# EAGLE design Shield (EAGLE 6.2)
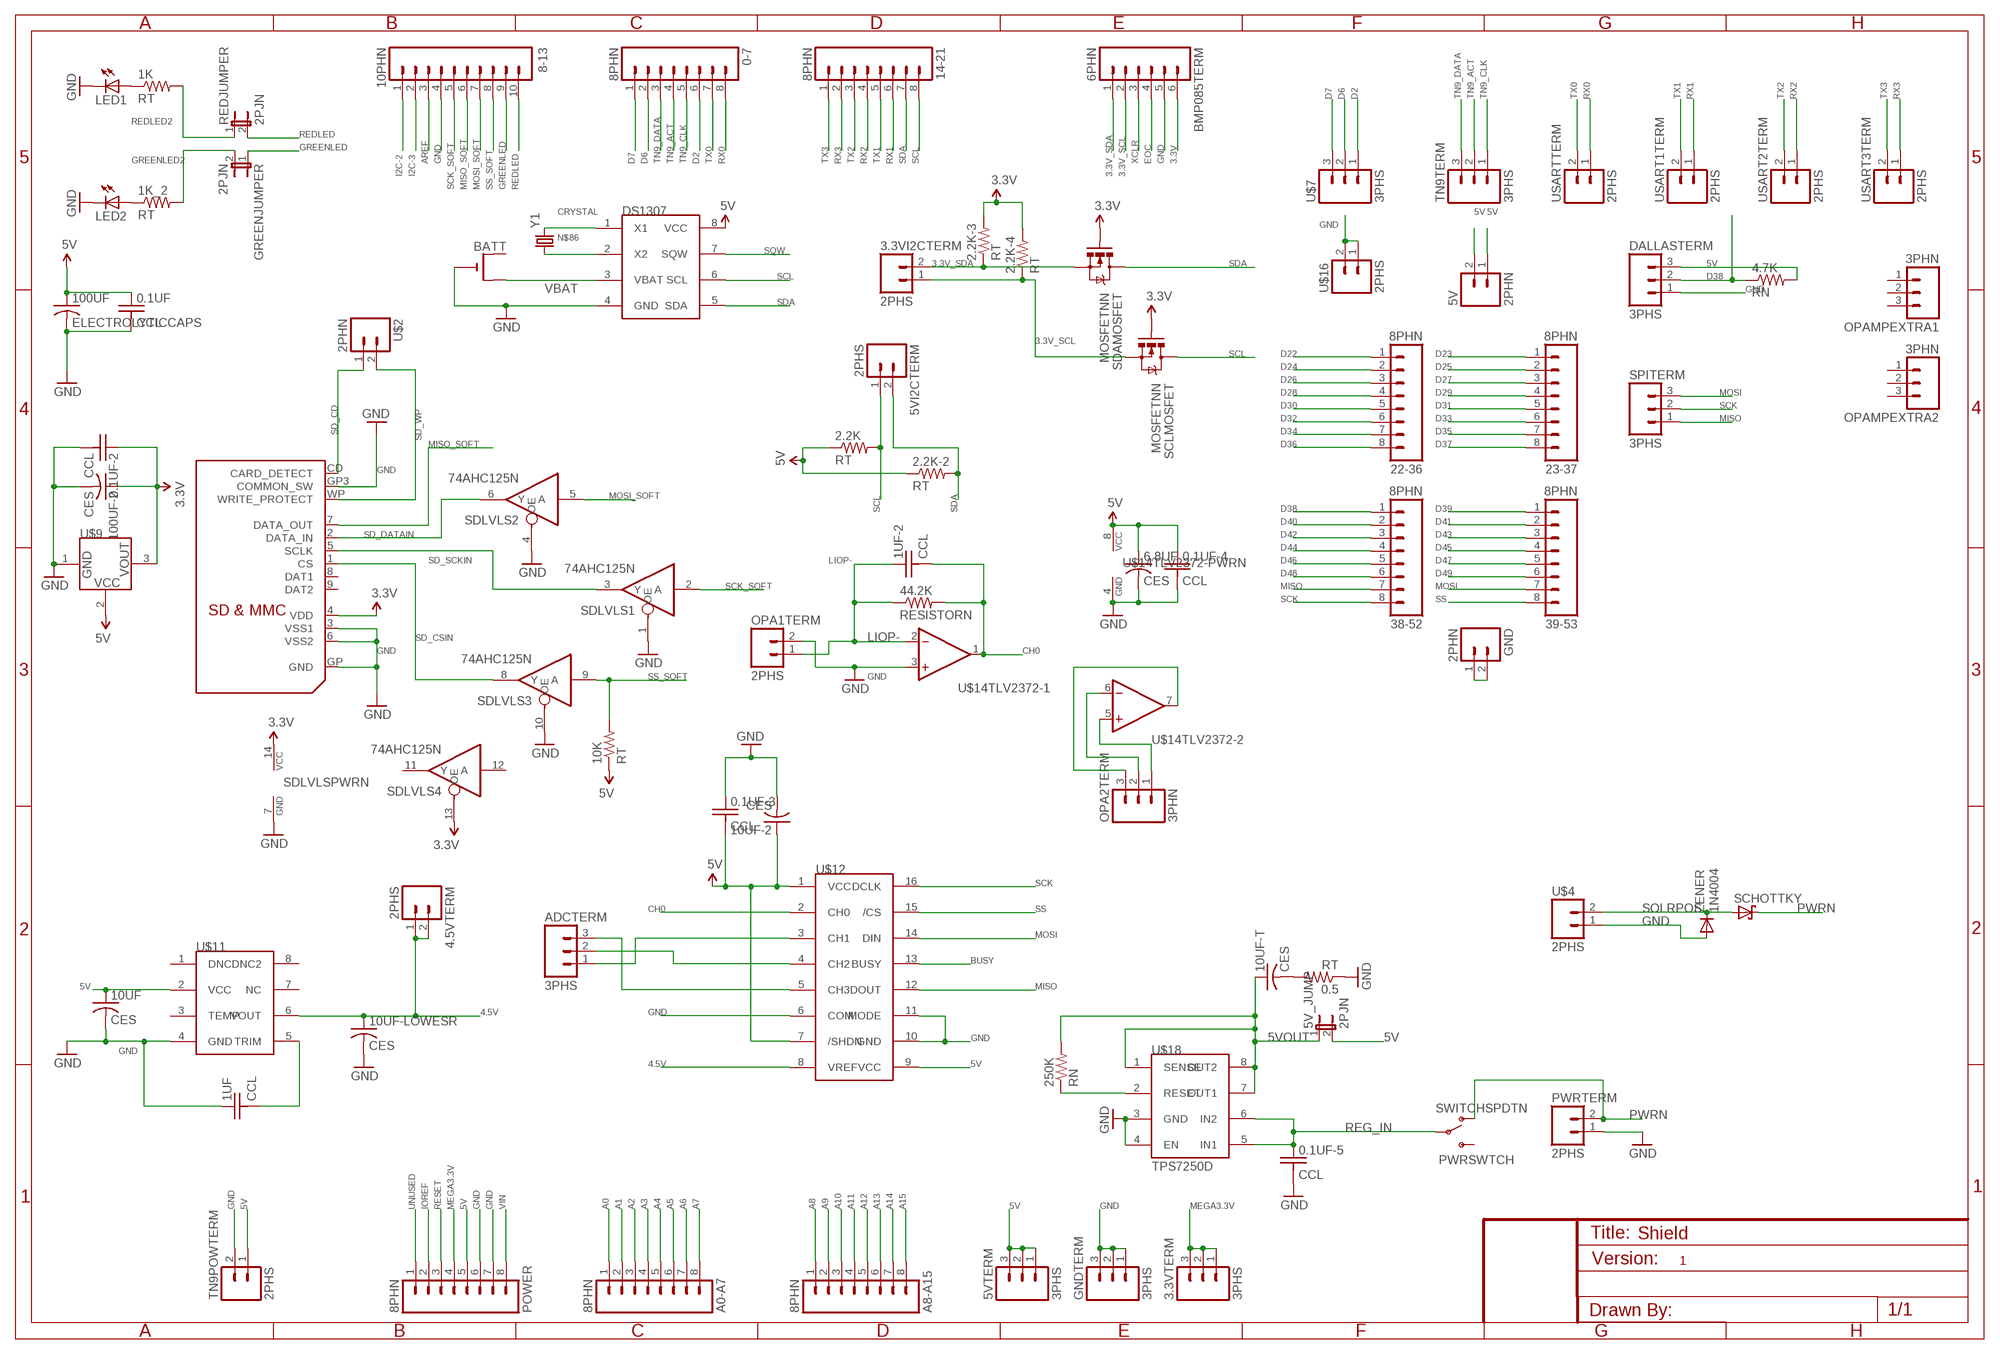
[diagram p0: schematic, sheet 1]

## Parts
0-7  8PHN  [8PH]
0.1UF  CCL  [C025-025X050]
0.1UF-2  CCL  [C025-025X050]
0.1UF-3  CCL  [C025-025X050]
0.1UF-4  CCL  [C025-025X050]
0.1UF-5  CCL  [C025-025X050]
0.5  RT  [0207/7]
1K  RT  [0207/7]
1K_2  RT  [0207/7]
1UF  CCL  [C025-025X050]
1UF-2  CCL  [C025-025X050]
2.2K  RT  [0207/7]
2.2K-2  RT  [0207/7]
2.2K-3  RT  [0207/7]
2.2K-4  RT  [0207/7]
3.3VI2CTERM  2PHS  [SCREWTERMINAL-3.5MM-2_LOCK]
3.3VTERM  3PHS  [SCREWTERMINAL-3.5MM-3_LOCK.007S]
4.5VTERM  2PHS  [SCREWTERMINAL-3.5MM-2_LOCK]
4.7K  RN  [0207/10]
5V  2PHN  [2PH]
5V_JUMP  2PJN  [2PH]
5VI2CTERM  2PHS  [SCREWTERMINAL-3.5MM-2_LOCK]
5VTERM  3PHS  [SCREWTERMINAL-3.5MM-3_LOCK.007S]
6.8UF  CES  [E2,5-5]
8-13  10PHN  [10PH]
10K  RT  [0207/7]
10UF  CES  [E2,5-5]
10UF-2  CES  [E2,5-5]
10UF-LOWESR  CES  [E2,5-5]
10UF-T  CES  [E2,5-5]
14-21  8PHN  [8PH]
22-36  8PHN  [8PH]
23-37  8PHN  [8PH]
38-52  8PHN  [8PH]
39-53  8PHN  [8PH]
44.2K  RESISTORN  [0207/10]
100UF  ELECTROLYTICCAPS  [E2,5-5]
100UF-2  CES  [E2,5-5]
250K  RN  [0207/10]
A0-A7  8PHN  [8PH]
A8-A15  8PHN  [8PH]
ADCTERM  3PHS  [SCREWTERMINAL-3.5MM-3_LOCK.007S]
BATT  CR1220THM  [CR1220-THM]
BMP085TERM  6PHN  [6PH]
DALLASTERM  3PHS  [SCREWTERMINAL-3.5MM-3_LOCK.007S]
DS1307  DS1307P  [DIL8]
GND  2PHN  [2PH]
GNDTERM  3PHS  [SCREWTERMINAL-3.5MM-3_LOCK.007S]
GREENJUMPER  2PJN  [2PH]
LED1  LED3MM  [LED3MM]
LED2  LED3MM  [LED3MM]
OPA1TERM  2PHS  [SCREWTERMINAL-3.5MM-2_LOCK]
OPA2TERM  3PHN  [3PH]
OPAMPEXTRA1  3PHN  [3PH]
OPAMPEXTRA2  3PHN  [3PH]
POWER  8PHN  [8PH]
PWRSWTCH  SWITCHSPDTN  [SWITCH-SPDT]
PWRTERM  2PHS  [SCREWTERMINAL-3.5MM-2_LOCK]
REDJUMPER  2PJN  [2PH]
SCHOTTKY  SCHOTTKY-DIODEDO41  [DO41-10]
SCLMOSFET  MOSFETNN  [TO-92INLINE]
SDAMOSFET  MOSFETNN  [TO-92INLINE]
SDLVLS  74AHC125N  [DIL14]
SPITERM  3PHS  [SCREWTERMINAL-3.5MM-3_LOCK.007S]
TN9POWTERM  2PHS  [SCREWTERMINAL-3.5MM-2_LOCK]
TN9TERM  3PHS  [SCREWTERMINAL-3.5MM-3_LOCK.007S]
U$1  SDMMC06132  [06132]
U$2  2PHN  [2PH]
U$4  2PHS  [SCREWTERMINAL-3.5MM-2_LOCK]
U$7  3PHS  [SCREWTERMINAL-3.5MM-3_LOCK.007S]
U$9  MCP1700-330T  [TO-92INLINE]
U$11  REF5045S  [SOIC8]
U$12  ADS7841P  [DIL16]
U$14  TLV2372P  [DIL8]
U$16  2PHS  [SCREWTERMINAL-3.5MM-2_LOCK]
U$18  TPS7250D  [DIL8]
USART1TERM  2PHS  [SCREWTERMINAL-3.5MM-2_LOCK]
USART2TERM  2PHS  [SCREWTERMINAL-3.5MM-2_LOCK]
USART3TERM  2PHS  [SCREWTERMINAL-3.5MM-2_LOCK]
USARTTERM  2PHS  [SCREWTERMINAL-3.5MM-2_LOCK]
Y1  CRYSTALTC38H  [TC38H]
ZENER  1N4004  [DO41-10]

## Nets
3.3V: 0.1UF-2.1 2.2K-3.2 2.2K-4.2 100UF-2.+ BMP085TERM.6 SCLMOSFET.2(G) SDAMOSFET.2(G) SDLVLS.13(4:OE) SDLVLS.14(PWRN:VCC) U$1.4(VDD) U$9.3(VOUT)
3.3V_SCL: 2.2K-4.1 3.3VI2CTERM.1 BMP085TERM.2 SCLMOSFET.1(S)
3.3V_SDA: 2.2K-3.1 3.3VI2CTERM.2 BMP085TERM.1 SDAMOSFET.1(S)
4.5V: 4.5VTERM.1 4.5VTERM.2 10UF-LOWESR.+ U$11.6(VOUT) U$12.8(VREF)
5V: 0.1UF-3.2 0.1UF-4.1 0.1UF.1 2.2K-2.1 2.2K.1 4.7K.2 5V.1 5V.2 5V_JUMP.2 5VTERM.1 5VTERM.2 5VTERM.3 6.8UF.+ 10K.1 10UF-2.+ 10UF.+ 100UF.+ DALLASTERM.3 DS1307.8(VCC) POWER.5 TN9POWTERM.1 U$9.2(VCC) U$11.2(VCC) U$12.1(VCC) U$12.7(/SHDN) U$12.9(VCC) U$14.8(TLV2372-PWRN:VCC)
5VOUT: 5V_JUMP.1 10UF-T.+ 250K.2 U$18.1(SENSE) U$18.7(OUT1) U$18.8(OUT2)
A0: A0-A7.1
A1: A0-A7.2
A2: A0-A7.3
A3: A0-A7.4
A4: A0-A7.5
A5: A0-A7.6
A6: A0-A7.7
A7: A0-A7.8
A8: A8-A15.1
A9: A8-A15.2
A10: A8-A15.3
A11: A8-A15.4
A12: A8-A15.5
A13: A8-A15.6
A14: A8-A15.7
A15: A8-A15.8
AREF: 8-13.3
BUSY: U$12.13(BUSY)
CH0: 1UF-2.2 44.2K.2 U$12.2(CH0) U$14.1(TLV2372-1:OUT)
CH1: ADCTERM.1 U$12.3(CH1)
CH2: ADCTERM.2 U$12.4(CH2)
CH3: ADCTERM.3 U$12.5(CH3)
CRYSTAL: DS1307.1(X1) Y1.2
D2: 0-7.6 U$7.1
D6: 0-7.2 U$7.2
D7: 0-7.1 U$7.3
D22: 22-36.1
D23: 23-37.1
D24: 22-36.2
D25: 23-37.2
D26: 22-36.3
D27: 23-37.3
D28: 22-36.4
D29: 23-37.4
D30: 22-36.5
D31: 23-37.5
D32: 22-36.6
D33: 23-37.6
D34: 22-36.7
D35: 23-37.7
D36: 22-36.8
D37: 23-37.8
D38: 4.7K.1 38-52.1 DALLASTERM.2
D39: 39-53.1
D40: 38-52.2
D41: 39-53.2
D42: 38-52.3
D43: 39-53.3
D44: 38-52.4
D45: 39-53.4
D46: 38-52.5
D47: 39-53.5
D48: 38-52.6
D49: 39-53.6
EOC: BMP085TERM.4
GND: 0.1UF-2.2 0.1UF-3.1 0.1UF-4.2 0.1UF-5.2 0.1UF.2 0.5.1 1UF.1 6.8UF.- 8-13.4 10UF-2.- 10UF-LOWESR.- 10UF.- 100UF-2.- 100UF.- BATT.- BMP085TERM.5 DALLASTERM.1 DS1307.4(GND) GNDTERM.1 GNDTERM.2 GNDTERM.3 LED1.K(C) LED2.K(C) OPA1TERM.2 POWER.6 POWER.7 PWRTERM.1 SDLVLS.1(1:OE) SDLVLS.4(2:OE) SDLVLS.7(PWRN:GND) SDLVLS.10(3:OE) TN9POWTERM.2 U$1.3(VSS1) U$1.6(VSS2) U$1.GP3(COMMON_SW) U$1.GP(GND) U$4.1 U$9.1(GND) U$11.4(GND) U$12.6(COM) U$12.10(GND) U$12.11(MODE) U$14.3(TLV2372-1:+IN) U$14.4(TLV2372-PWRN:GND) U$16.1 U$16.2 U$18.3(GND) U$18.4(EN) ZENER.A
GREENLED: 8-13.9 GREENJUMPER.1
GREENLED2: 1K_2.2 GREENJUMPER.2
I2C-2: 8-13.1
I2C-3: 8-13.2
IOREF: POWER.2
LIOP-: 1UF-2.1 44.2K.1 OPA1TERM.1 U$14.2(TLV2372-1:-IN)
MEGA3.3V: 3.3VTERM.1 3.3VTERM.2 3.3VTERM.3 POWER.4
MISO: 38-52.7 SPITERM.1 U$12.12(DOUT)
MISO_SOFT: 8-13.6 U$1.7(DATA_OUT)
MOSI: 39-53.7 SPITERM.3 U$12.14(DIN)
MOSI_SOFT: 8-13.7 SDLVLS.5(2:A)
N$1: 1UF.2 U$11.5(TRIM)
N$2: OPA2TERM.1 U$14.5(TLV2372-2:+IN)
N$3: OPA2TERM.2 U$14.6(TLV2372-2:-IN)
N$4: OPA2TERM.3 U$14.7(TLV2372-2:OUT)
N$5: GND.1 GND.2
N$6: 250K.1 U$18.2(RESET)
N$7: 0.5.2 10UF-T.-
N$83: 1K.1 LED1.A
N$84: 1K_2.1 LED2.A
N$86: DS1307.2(X2) Y1.1
PWRN: PWRSWTCH.1(O) PWRTERM.2 SCHOTTKY.C
REDLED: 8-13.10 REDJUMPER.2
REDLED2: 1K.2 REDJUMPER.1
REG_IN: 0.1UF-5.1 PWRSWTCH.2(P) U$18.5(IN1) U$18.6(IN2)
RESET: POWER.3
RX0: 0-7.8 USARTTERM.1
RX1: 14-21.6 USART1TERM.1
RX2: 14-21.4 USART2TERM.1
RX3: 14-21.2 USART3TERM.1
SCK: 38-52.8 SPITERM.2 U$12.16(DCLK)
SCK_SOFT: 8-13.5 SDLVLS.2(1:A)
SCL: 2.2K.2 5VI2CTERM.1 14-21.8 DS1307.6(SCL) SCLMOSFET.3(D)
SD_CD: U$1.CD(CARD_DETECT) U$2.1
SD_CSIN: SDLVLS.8(3:Y) U$1.1(CS)
SD_DATAIN: SDLVLS.6(2:Y) U$1.2(DATA_IN)
SD_SCKIN: SDLVLS.3(1:Y) U$1.5(SCLK)
SD_WP: U$1.WP(WRITE_PROTECT) U$2.2
SDA: 2.2K-2.2 5VI2CTERM.2 14-21.7 DS1307.5(SDA) SDAMOSFET.3(D)
SOLRPOS: SCHOTTKY.A U$4.2 ZENER.C
SQW: DS1307.7(SQW)
SS: 39-53.8 U$12.15(/CS)
SS_SOFT: 8-13.8 10K.2 SDLVLS.9(3:A)
TN9_ACT: 0-7.4 TN9TERM.2
TN9_CLK: 0-7.5 TN9TERM.1
TN9_DATA: 0-7.3 TN9TERM.3
TX0: 0-7.7 USARTTERM.2
TX1: 14-21.5 USART1TERM.2
TX2: 14-21.3 USART2TERM.2
TX3: 14-21.1 USART3TERM.2
UNUSED: POWER.1
VBAT: BATT.+2(+1) DS1307.3(VBAT)
VIN: POWER.8
XCLR: BMP085TERM.3
Unconnected: BATT.+1(+) OPAMPEXTRA1.1 OPAMPEXTRA1.2 OPAMPEXTRA1.3 OPAMPEXTRA2.1 OPAMPEXTRA2.2 OPAMPEXTRA2.3 PWRSWTCH.3(S) SDLVLS.11(4:Y) SDLVLS.12(4:A) U$1.8(DAT1) U$1.9(DAT2) U$11.1(DNC) U$11.3(TEMP) U$11.7(NC) U$11.8(DNC2)

## Notes on the sheet
- 1

## Library data of the parts
0-7 14-21 22-36 23-37 38-52 39-53 A0-A7 A8-A15 POWER = LEMS:8PH: 8 Pin Header Lock
0.1UF 0.1UF-2-0.1UF-5 1UF 1UF-2 = LEMS:CC: Generic Ceramic Capacitor
0.5 1K 1K_2 2.2K 2.2K-2-2.2K-4 4.7K 10K 250K = LEMS:R: Standard Through Hole Resistor - Type 0207 - 10 Mil Spacing
3.3VI2CTERM 4.5VTERM 5V 5VI2CTERM GND OPA1TERM PWRTERM TN9POWTERM U$2 U$4 U$16 USART1TERM USART2TERM USART3TERM USARTTERM = LEMS:2PH: 2 Pin Header
3.3VTERM 5VTERM ADCTERM DALLASTERM GNDTERM OPA2TERM OPAMPEXTRA1 OPAMPEXTRA2 SPITERM TN9TERM U$7 = LEMS:3PH: 3 Pin Header Lock
5V_JUMP GREENJUMPER REDJUMPER = LEMS:2PJ: 2 Pin Jumper
6.8UF 10UF 10UF-2 10UF-LOWESR 10UF-T 100UF-2 = LEMS:CE: Generic Electrolytic Capacitor
8-13 = LEMS:10PH: 10 Pin Header Lock
44.2K = LEMS:RESISTOR: Standard Through Hole Resistor - Type 0207 - 10 Mil Spacing
100UF = LEMS:ELECTROLYTICCAP: Generic Electrolytic Capacitor
BATT = LEMS:CR1220: CR1216/CR1220/CR1225 12mm 3V lithium coin cell Great for battery packup. Both SMT and THM holders. Note the THM package has the ground pads on both sides of the PCB so that the masks are the same - this reduces the cost
BMP085TERM = LEMS:6PH: 6 Pin Header Lock
DS1307 = LEMS:DS1307: Real Time Clock by Maxim
LED1 LED2 = LEMS:LED: LEDs Standard schematic elements and footprints for 5mm, 3mm, 1206, and 0603 sized LEDs. 5mm - Spark Fun Electronics SKU : COM-00529 (and others)
PWRSWTCH = LEMS:SWITCHSPDT
SCHOTTKY = adafruit:SCHOTTKY-DIODE: Schottky Diode
SCLMOSFET SDAMOSFET = LEMS:MOSFETN: N-Channel Mosfet
SDLVLS = LEMS:74AHC125: Quadruple Bus Buffer Gate by TI
U$1 = LEMS:SDMMC: SD MMC Card holder 4UCON part #06132 - easy to solder
U$9 = LEMS:MCP1700-330: 3.3V Voltage Regulator by Microchip
U$11 = LEMS:REF5045: 4.5V Series Reference by TI
U$12 = LEMS:ADS7841: 4 Channel 12 bit ADC by Burr-Brown
U$14 = LEMS:TLV2372: 2-Channel Single-Supply Rail-to-Rail Op-Amp by TI
U$18 = LEMS:TPS7250: 5 V Low Dropout Voltage Regulator by TI
Y1 = LEMS:CRYSTAL: TC38H Crystal - Generic
ZENER = LEMS:1N4004: DIODE General purpose 1N400x type rectifier (With bigger pads) http://www.ladyada.net/library/pcb/eaglelibrary.html

## Board
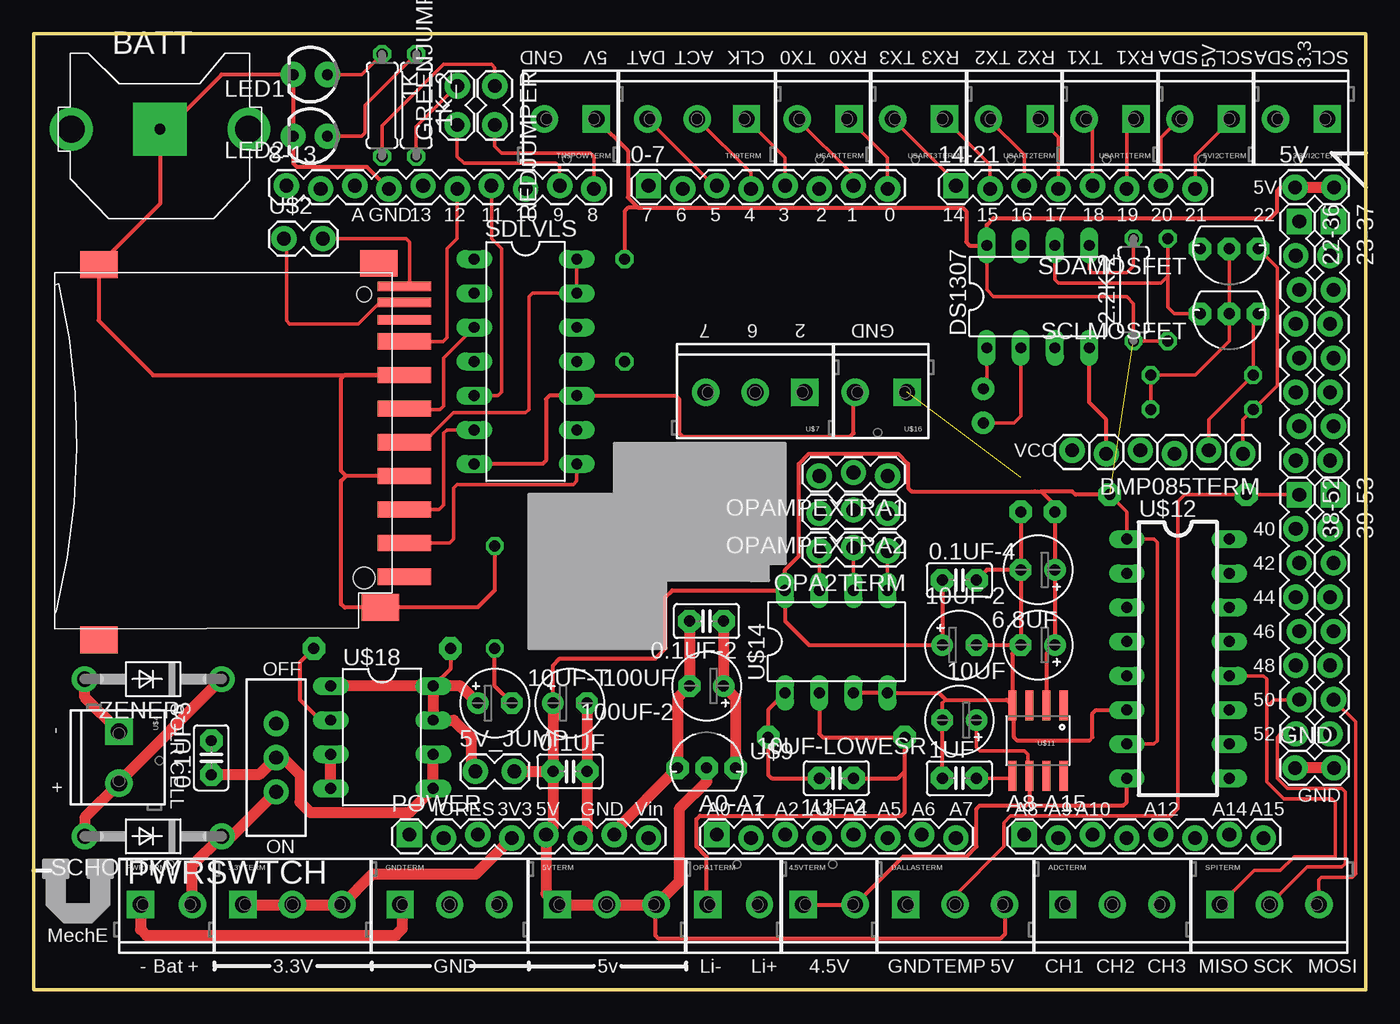
[diagram p1: board, top side]
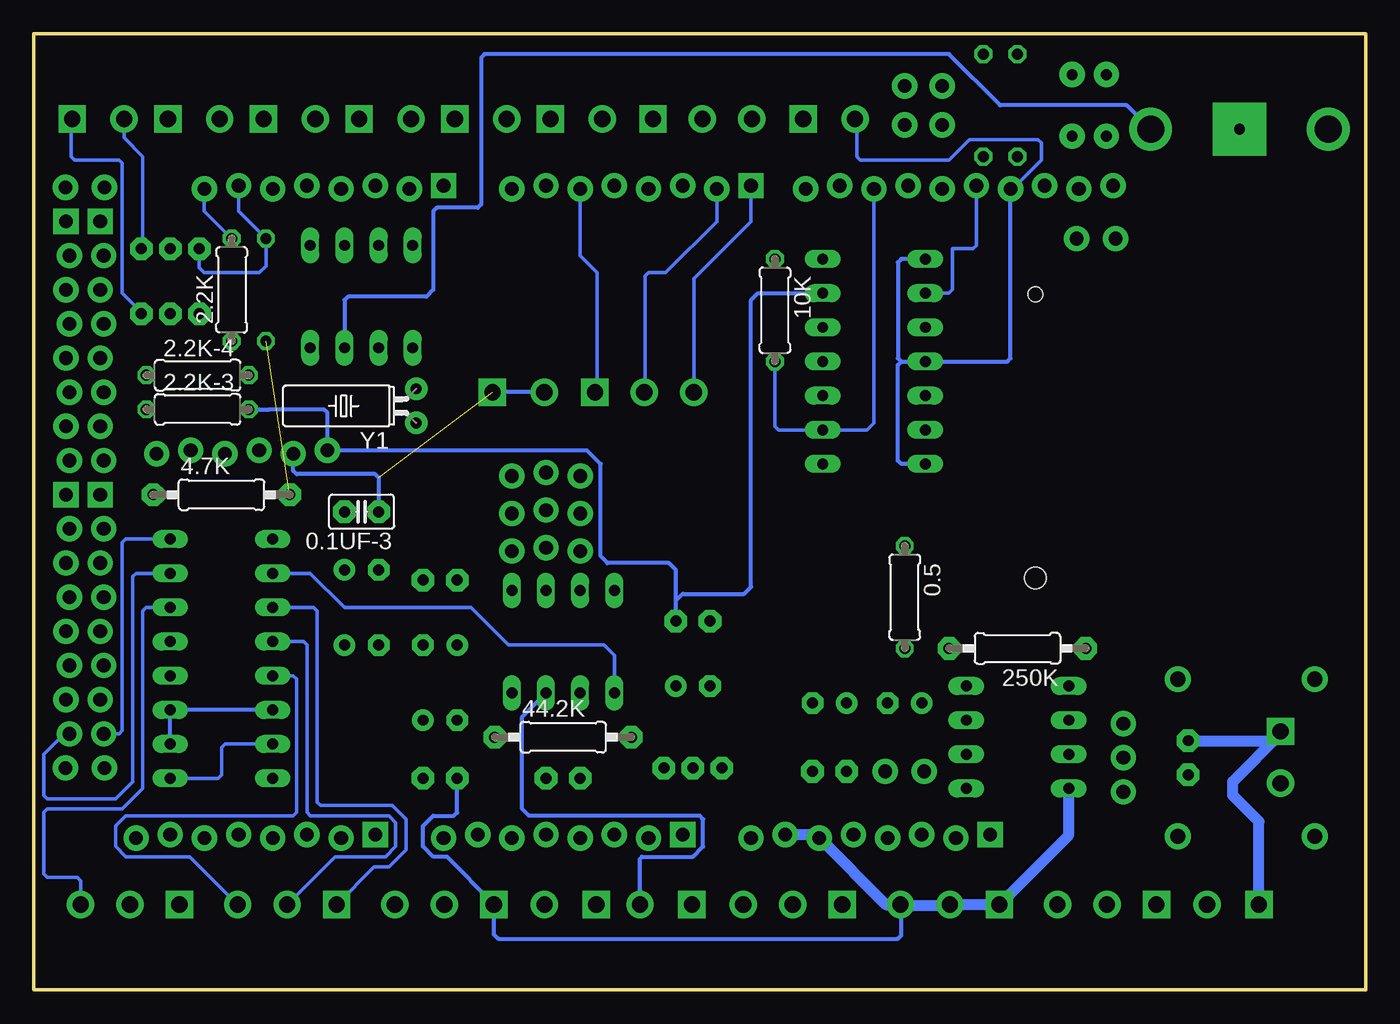
[diagram p2: board, bottom side, seen from below]

Size 99.06 x 71.12 mm. Coordinates in mm from the lower left corner, seen from the top.
Outline: 99.06,71.12 99.06,0 0,0 0,71.12 99.06,71.12
Copper layers (1*16): Top 0.035mm / dielectric 1.5mm / Bottom 0.035mm
Design rules: minimum track width 8mil, minimum drill 10mil, track to track 8mil, track to pad 8mil, pad to pad 8mil, via to via 8mil, smd to smd 8mil, copper to edge 10mil, drill to drill 8mil, minimum pad ring 10mil, minimum via ring 8mil, stop-mask expansion 4mil, vias tented up to drill 0mil, thermal gap 10mil

### Footprints (pad centres in the part's own frame; a part is rotated, then mirrored left to right if it is on the bottom)
8PH = drill 1.016 pad 1.88 square: 1 -8.89,0.127 | drill 1.016 pad 1.88: 2 -6.35,-0.127; 3 -3.81,0.127; 4 -1.27,-0.127; 5 1.27,0.127; 6 3.81,-0.127; 7 6.35,0.127; 8 8.89,-0.127
C025-025X050 = drill 0.813 pad 1.676 octagon: 1 -1.27,0; 2 1.27,0
0207/7 = drill 0.813 octagon: 1 -3.81,0; 2 3.81,0
SCREWTERMINAL-3.5MM-2_LOCK = drill 1.2 pad 2.032 square: 1 -0.178,0 | drill 1.2 pad 2.032: 2 3.678,0
SCREWTERMINAL-3.5MM-3_LOCK.007S = drill 1.2 pad 2.032 square: 1 -0.178,0 | drill 1.2 pad 2.032: 2 3.5,0; 3 7.178,0
0207/10 = drill 0.813 pad 1.676 octagon: 1 -5.08,0; 2 5.08,0
2PH = drill 1.016 pad 1.88: 1 -1.448,0; 2 1.448,0
E2,5-5 = drill 0.813 pad 1.6: + -1.27,0 | drill 0.813 pad 1.6 octagon: - 1.27,0
10PH = drill 1.016 pad 1.88: 1 0,0.127; 2 2.54,-0.127; 3 5.08,0.127; 4 7.62,-0.127; 5 10.16,0.127; 6 12.7,-0.127; 7 15.24,0.127; 8 17.78,-0.127; 9 20.32,0.127; 10 22.86,-0.127
CR1220-THM = drill 2 pad 3.175: +1 -6.604,0; +2 6.604,0 | drill 0.8 pad 3.962 square: - 0,0
6PH = drill 1.016 pad 1.88: 1 -6.35,0; 2 -3.81,-0.254; 3 -1.27,0; 4 1.27,-0.254; 5 3.81,0; 6 6.35,-0.254
DIL8 = drill 0.813 long: 1 -3.81,-3.81; 2 -1.27,-3.81; 3 1.27,-3.81; 4 3.81,-3.81; 5 3.81,3.81; 6 1.27,3.81; 7 -1.27,3.81; 8 -3.81,3.81
LED3MM = drill 0.813 pad 1.88: A -1.27,0; K 1.27,0
3PH = drill 1.016 pad 1.88: 1 0,0.127; 2 2.54,-0.127; 3 5.08,0.127
SWITCH-SPDT = drill 1.016 pad 1.88: 1 0,2.54; 2 0,0; 3 0,-2.54
DO41-10 = drill 1.118 pad 1.93: A 5.08,0; C -5.08,0
TO-92INLINE = drill 0.813 pad 1.676 octagon: 1 -2.159,0; 2 0,0; 3 2.159,0
DIL14 = drill 0.813 long: 1 -7.62,-3.81; 2 -5.08,-3.81; 3 -2.54,-3.81; 4 0,-3.81; 5 2.54,-3.81; 6 5.08,-3.81; 7 7.62,-3.81; 8 7.62,3.81; 9 5.08,3.81; 10 2.54,3.81; 11 0,3.81; 12 -2.54,3.81; 13 -5.08,3.81; 14 -7.62,3.81
06132 = smd 1.2 x 4: 1 6.9,0.9; 2 4.4,0.9; 3 1.9,0.9; 4 -0.6,0.9; 5 -3.1,0.9; 6 -5.6,0.9; 7 -8.1,0.9; 9 9.4,0.9 | smd 0.7 x 4: 8 -9.7,0.9; CD -11,0.9; WP -12.2,0.9 | smd 2 x 2.8: GP -13.8,-21.8; GP2 14.1,-21.8; GP3 11.7,-0.9; GP4 -13.9,-1 | hole 1.1: -11.6,-2.1 | hole 1.6: 9.5,-2.1
SOIC8 = smd 0.61 x 2.21: 1 -1.905,-2.616; 2 -0.635,-2.616; 3 0.635,-2.616; 4 1.905,-2.616; 5 1.905,2.616; 6 0.635,2.616; 7 -0.635,2.616; 8 -1.905,2.616
DIL16 = drill 0.813 long: 1 -8.89,-3.81; 2 -6.35,-3.81; 3 -3.81,-3.81; 4 -1.27,-3.81; 5 1.27,-3.81; 6 3.81,-3.81; 7 6.35,-3.81; 8 8.89,-3.81; 9 8.89,3.81; 10 6.35,3.81; 11 3.81,3.81; 12 1.27,3.81; 13 -1.27,3.81; 14 -3.81,3.81; 15 -6.35,3.81; 16 -8.89,3.81
TC38H = drill 0.813 pad 1.676: 1 -1.27,0; 2 1.27,0

### Placement (x,y rotation side)
0-7  54.61,59.69 0 top
0.1UF  39.88,16.26 0 top
0.1UF-2  50.04,27.43 180 top
0.1UF-3  74.68,35.56 180 bottom
0.1UF-4  68.83,30.48 0 top
0.1UF-5  13.21,17.27 90 top
0.5  34.29,29.21 270 bottom
1K  25.91,65.79 270 top
1K_2  28.45,65.79 270 top
1UF  68.83,15.75 0 top
1UF-2  59.69,15.75 180 top
2.2K  84.33,52.07 90 bottom
2.2K-2  81.79,52.07 90 top
2.2K-3  86.87,43.18 0 bottom
2.2K-4  86.87,45.72 0 bottom
3.3VI2CTERM  96.01,64.77 180 top
3.3VTERM  15.75,6.35 0 top
4.5VTERM  57.4,6.35 0 top
4.7K  85.09,36.83 0 bottom
5V  95.25,59.69 0 top
5V_JUMP  34.29,16.26 0 top
5VI2CTERM  88.9,64.77 180 top
5VTERM  39.12,6.35 0 top
6.8UF  68.83,25.65 0 top
8-13  18.8,59.69 0 top
10K  43.94,50.55 270 bottom
10UF  74.68,25.65 180 top
10UF-2  74.68,31.24 180 top
10UF-LOWESR  68.83,20.07 180 top
10UF-T  34.29,21.34 0 top
14-21  77.47,59.69 0 top
22-36  93.98,48.26 270 top
23-37  96.52,48.26 270 top
38-52  93.98,27.94 270 top
39-53  96.52,27.94 270 top
44.2K  59.69,18.8 0 bottom
100UF  39.88,21.34 0 top
100UF-2  50.04,22.61 180 top
250K  25.91,25.4 180 bottom
A0-A7  59.69,11.43 0 top
A8-A15  82.55,11.43 0 top
ADCTERM  76.71,6.35 0 top
BATT  9.4,64.01 0 top
BMP085TERM  83.57,39.88 180 top
DALLASTERM  65.02,6.35 0 top
DS1307  74.68,51.56 0 top
GND  95.25,16.51 0 top
GNDTERM  27.43,6.35 0 top
GREENJUMPER  31.5,65.79 90 top
LED1  20.57,68.07 180 top
LED2  20.57,63.5 180 top
OPA1TERM  50.29,6.35 0 top
OPA2TERM  63.5,32.77 180 top
OPAMPEXTRA1  63.5,38.35 180 top
OPAMPEXTRA2  63.5,35.56 180 top
POWER  36.83,11.43 0 top
PWRSWTCH  18.03,17.27 180 top
PWRTERM  8.13,6.35 0 top
REDJUMPER  34.29,65.79 270 top
SCHOTTKY  8.89,11.43 180 top
SCLMOSFET  88.9,50.29 180 top
SDAMOSFET  88.9,55.12 180 top
SDLVLS  36.58,46.74 270 top
SPITERM  88.39,6.35 0 top
TN9POWTERM  41.66,64.77 180 top
TN9TERM  52.83,64.77 180 top
U$1  26.67,40.13 270 top
U$2  20.07,55.88 0 top
U$4  6.35,19.05 270 top
U$7  57.15,44.45 180 top
U$9  50.04,16.51 0 top
U$11  74.68,18.54 180 top
U$12  85.09,24.64 270 top
U$14  59.69,25.91 0 top
U$16  64.77,44.45 180 top
U$18  25.91,18.8 270 top
USART1TERM  81.79,64.77 180 top
USART2TERM  74.68,64.77 180 top
USART3TERM  67.56,64.77 180 top
USARTTERM  60.45,64.77 180 top
Y1  70.61,43.43 90 bottom
ZENER  8.89,23.11 180 top

### Tracks (layer width: path | path; a pad name or v marks a point on that pad's centre or on a via)
3.3V
  Top 0.254: SDAMOSFET.2 SCLMOSFET.2 88.9,48.26 86.36,45.72 2.2K-4.2 2.2K-3.2 | U$1.4 29.05,40.73 31.24,42.93 36.58,42.93 36.83,43.18 36.83,51.56 37.08,51.82 SDLVLS.13 SDLVLS.14
  Top 0.813: 0.1UF-2.1 100UF-2.+ 52.2,21.72 U$9.3
  Bottom 0.305: 0.1UF-2.1 51.31,28.96 | 51.31,28.96 50.8,29.46 46.23,29.46 45.72,29.97 45.72,51.31 45.21,51.82 SDLVLS.13 | 51.31,28.96 51.31,31.24 51.82,31.75 56.39,31.75 56.9,32.26 56.9,39.12 57.91,40.13 BMP085TERM.6 77.22,42.93 77.47,43.18 81.53,43.18 82.3,43.18 2.2K-3.2
3.3V_SCL
  Top 0.254: SCLMOSFET.1 90.68,49.91 2.2K-4.1 87.38,42.42 BMP085TERM.2
  Bottom 0.254: SCLMOSFET.1 91.06,50.42 92.46,51.82 92.46,61.47 92.71,61.72 96.01,61.72 96.27,61.98 96.27,64.69 3.3VI2CTERM.1
3.3V_SDA
  Top 0.254: SDAMOSFET.1 92.46,53.72 92.46,44.96 2.2K-3.1 89.92,42.42 BMP085TERM.1
  Bottom 0.254: 3.3VI2CTERM.2 92.33,63.38 90.93,61.98 90.93,55.24 SDAMOSFET.1
4.5V
  Top 0.254: 10UF-LOWESR.+ 70.1,18.03 70.36,17.78 73.66,17.78 73.91,17.53 73.91,16.05 U$11.6
  Top 0.305: U$11.6 74.04,13.97 | 74.04,13.97 74.04,13.84 74.17,13.72 81.03,13.72 81.28,13.97 U$12.8 | 4.5VTERM.1 4.5VTERM.2 64.64,9.91 69.34,9.91 70.1,10.67 70.1,13.46 70.36,13.72 73.79,13.72 74.04,13.97
5V  (1 unrouted)
  Top 0.254: 2.2K.1 2.2K-2.1 81.79,51.05 81.28,51.56 71.37,51.56 70.87,52.07 DS1307.8 | U$12.7 83.31,18.29 83.57,18.54 83.57,33.27 83.31,33.53 U$12.1 81.28,35.56 4.7K.2
  Top 0.305: 5V.1 92.71,59.69 92.46,59.44 92.46,57.91 91.95,57.4 71.37,57.4 70.87,56.9 DS1307.8 69.6,55.37 69.34,55.63 69.34,57.91 69.09,58.17 44.96,58.17 | TN9POWTERM.1 44.2,62.41 44.2,58.93 44.96,58.17 | 44.96,58.17 44.2,58.17 43.94,57.91 10K.1 | U$11.2 75.31,25.02 10UF.+ 10UF-2.+ 0.1UF-3.2 75.95,36.07 74.93,37.08 | DALLASTERM.3 72.2,4.13 71.88,3.81 46.48,3.81 46.23,4.06 46.23,6.28 5VTERM.3 | 0.1UF-4.1 6.8UF.+ 57.66,25.65 55.88,27.43 U$14.8 | 100UF.+ 38.61,24.13 39.12,24.64 46.23,24.64 46.99,25.4 46.99,29.21 47.5,29.72 U$14.8 | U$14.8 55.88,31.24 56.9,32.26 56.9,39.12 57.66,39.88 64.26,39.88 65.02,39.12 65.02,37.34 65.28,37.08 74.42,37.08 74.93,37.08 | 4.7K.2 77.47,36.83 77.22,37.08 74.93,37.08
  Top 0.813: 5V.1 5V.2 | 5V_JUMP.2 0.1UF.1 | 100UF.+ 0.1UF.1 | 0.1UF.1 38.61,12.06 POWER.5 38.1,7.19 5VTERM.1 5VTERM.2 5VTERM.3 48.01,8.06 48.01,13.46 50.04,15.49 U$9.2
  Bottom 0.254: U$12.7 84.84,18.29 85.09,18.03 85.09,16 85.34,15.75 U$12.9
5VOUT
  Top 0.305: 250K.2 30.99,23.88 U$18.8
  Top 0.813: U$18.8 29.21,22.61 U$18.1 | U$18.8 U$18.7 31.24,20.07 32.51,18.8 32.51,16.59 5V_JUMP.1 | 10UF-T.+ 31.75,22.61 U$18.8
CH0
  Top 0.305: U$14.1 54.61,20.83 44.2K.2 54.61,16 54.86,15.75 1UF-2.2
  Bottom 0.254: U$14.1 55.88,24.89 56.64,25.65 63.75,25.65 66.55,28.45 75.95,28.45 78.49,30.99 U$12.2
CH1
  Bottom 0.254: U$12.3 78.23,28.45 77.98,28.19 77.98,13.97 77.72,13.72 72.39,13.72 71.37,12.7 71.37,10.41 72.64,9.14 73.74,9.14 ADCTERM.1
CH2
  Bottom 0.254: ADCTERM.2 76.65,9.91 72.9,9.91 72.14,10.67 72.14,12.45 72.64,12.95 78.49,12.95 78.74,13.21 78.74,25.65 78.99,25.91 U$12.4
CH3
  Bottom 0.254: U$12.5 79.76,23.37 79.5,23.11 79.5,13.21 79.76,12.95 92.2,12.95 92.96,12.19 92.96,10.67 92.2,9.91 87.44,9.91 ADCTERM.3
CRYSTAL
  Top 0.254: Y1.2 70.87,44.96 DS1307.1
D2
  Bottom 0.254: 0-7.6 58.42,54.61 57.15,53.34 57.15,44.63
  Bottom 0.305: 57.15,44.63 U$7.1
D6
  Bottom 0.254: 0-7.2 48.26,57.15 52.07,53.34 53.34,53.34 53.59,53.09 53.59,44.51
  Bottom 0.305: 53.59,44.51 U$7.2
D7
  Bottom 0.254: 0-7.1 45.72,57.15 49.97,52.9 U$7.3
D38
  Top 0.254: DALLASTERM.2 68.52,7.06 72.14,10.67 72.14,12.45 72.64,12.95 84.58,12.95 85.09,13.46 85.09,36.32 85.6,36.83 4.7K.1 38-52.1
GND  (1 unrouted)
  Top 0.254: 72.9,21.03 U$11.4 72.34,21.59 | 78.49,18.54 78.74,18.8 | 67.56,21.34 67.82,21.59
  Top 0.305: 8-13.4 24.77,61.21 19.56,61.21 19.3,61.47 LED2.K LED1.K 13.97,68.07 9.4,63.5 | BATT.- 9.4,63.5 | 9.4,63.5 9.4,58.46 U$1.GP 4.83,53.89 4.83,49.78 8.89,45.72 27.56,45.72 U$1.6 27.93,45.73 27.94,45.72 23.11,45.72 22.86,45.47 22.86,38.61 23.24,38.23 | U$1.3 23.24,38.23 | U$1.GP3 25.15,28.43 23.13,28.43 22.86,28.7 22.86,37.86 23.24,38.23 | 78.49,18.54 73.15,18.54 72.9,18.8 72.9,21.03 | 78.74,18.8 78.74,20.57 78.99,20.83 U$12.6 | 1UF.1 10UF-LOWESR.- 67.56,21.34 | 0.1UF-3.1 10UF-2.- | 10UF-2.- 10UF.- | 10UF.- 72.77,25.02 U$11.4 | 72.34,21.59 67.82,21.59 67.31,22.1 U$14.4 U$14.3 | 10UF-2.- 70.87,31.24 0.1UF-4.2 | 6.8UF.- 10UF.- | 0.5.1 34.29,29.72 33.02,28.45 25.16,28.45 | SDLVLS.7 37.85,39.12 38.1,39.37 38.1,43.94 38.35,44.2 SDLVLS.10 47.75,44.2 48.01,43.94 48.01,41.4 48.26,41.15 60.71,41.15 60.96,41.4 60.96,44.32 U$16.2 | BMP085TERM.5 79.76,42.42 78.49,43.69 DS1307.4
  Top 0.813: PWRTERM.1 7.95,4.5 8.38,4.06 26.92,4.06 27.43,4.57 27.43,6.17 GNDTERM.1 | U$18.4 U$18.3 | U$4.1 3.81,21.77 ZENER.A | 25.16,28.45 25.15,28.43 | 100UF.- 0.1UF.2 41.15,11.81 POWER.6 | 0.1UF-2.2 100UF-2.- 47.88,21.72 U$9.1 43.18,11.81 POWER.7
  Bottom 0.254: TN9POWTERM.2 37.85,64.64 37.85,61.98 37.59,61.72 30.99,61.72 29.46,63.25 24.38,63.25 24.13,62.99 24.13,61.72 26.29,59.56 8-13.4 | DALLASTERM.1 64.85,6.43 | 53.97,9.78 53.85,9.91
  Bottom 0.305: U$12.6 U$12.11 U$12.10 | SDLVLS.1 34.54,54.36 34.8,54.1 34.8,46.99 34.54,46.74 | 34.54,46.74 SDLVLS.4 26.67,46.74 26.42,46.99 8-13.4 | SDLVLS.7 34.54,39.12 34.8,39.37 34.8,46.48 34.54,46.74 | 64.85,6.43 68.33,9.91 69.34,9.91 70.1,10.67 70.1,12.19 69.34,12.95 67.82,12.95 67.56,13.21 1UF.1 | OPA1TERM.2 53.97,9.78 | 53.85,9.91 50.04,9.91 49.28,10.67 49.28,12.7 49.53,12.95 62.23,12.95 62.74,13.46 62.74,20.32 U$14.3 | DALLASTERM.1 64.85,4.14 64.52,3.81 34.8,3.81 34.54,4.06 34.54,6.28 GNDTERM.3 | 0.1UF-3.1 73.41,38.1 73.66,38.35 79.5,38.35 79.76,38.61 BMP085TERM.5 | U$16.2 U$16.1
  Bottom 0.813: POWER.7 40.89,11.56 POWER.6 35.69,6.35 GNDTERM.3 | U$18.4 22.1,11.51 GNDTERM.1 GNDTERM.2 31,6.28 34.54,6.28 | PWRTERM.1 7.95,12.52 9.91,14.48 9.91,15.49 6.35,19.05 U$4.1 7.04,18.54 0.1UF-5.2
GREENLED
  Top 0.254: 8-13.9 39.12,61.21 38.86,61.47 32,61.47 31.5,61.98 GREENJUMPER.1
GREENLED2
  Top 0.254: GREENJUMPER.2 28.45,64.19 1K_2.2
LIOP-
  Top 0.254: OPA1TERM.1 50.04,6.43
  Top 0.305: 50.04,6.43 50.04,9.91 49.28,10.67 49.28,12.7 49.53,12.95 64.52,12.95 64.77,13.21 64.77,16.26 | 64.77,16.26 44.2K.1 58.67,18.8 58.42,19.05 U$14.2 | 1UF-2.1 64.26,15.75 64.77,16.26
MEGA3.3V
  Top 0.813: 3.3VTERM.1 3.3VTERM.2 3.3VTERM.3 25.21,8.64 32.89,8.64 POWER.4
MISO
  Top 0.254: 38-52.7 92.2,21.59 91.69,21.08 | 91.69,21.08 91.69,15.49 92.96,14.22 96.52,14.22 96.77,13.97 96.77,9.91 93.73,9.91 92.71,8.89 90.75,8.89 SPITERM.1 | 91.69,21.08 91.69,23.11 91.44,23.37 U$12.12
MISO_SOFT
  Top 0.254: U$1.7 30.45,48.23 30.73,48.51 30.73,55.12 31.5,55.88 8-13.6
MOSI
  Top 0.254: SPITERM.3 95.57,8.19 95.76,8.38 98.04,8.38 98.3,8.64 98.3,19.94 39-53.7
  Bottom 0.254: U$12.14 90.68,28.45 90.93,28.19 90.93,14.99 92.46,13.46 98.04,13.46 98.3,13.21 98.3,8.64 98.04,8.38 95.82,8.38 95.57,8.13 SPITERM.3
MOSI_SOFT
  Top 0.254: SDLVLS.5 34.54,44.2 34.8,44.45 34.8,55.12 34.04,55.88 8-13.7
N$1
  Top 0.254: U$11.5 72.59,15.75 1UF.2
N$2
  Top 0.254: U$14.5 OPA2TERM.1
N$3
  Top 0.254: U$14.6 OPA2TERM.2
N$4
  Top 0.254: U$14.7 OPA2TERM.3
N$5
  Top 0.813: GND.2 GND.1
N$6
  Top 0.305: U$18.2 21.34,20.07 19.81,21.59 19.81,24.38 250K.1
N$7
  Top 0.305: 10UF-T.- 34.29,22.61 0.5.2
N$83
  Top 0.254: 1K.1 24.38,68.07 LED1.A
N$84
  Top 0.254: 1K_2.1 24.64,65.79 24.64,63.75 24.38,63.5 LED2.A
N$86
  Top 0.254: Y1.1 72.9,42.16 73.41,42.67 DS1307.2
PWRN
  Top 0.813: PWRTERM.2 11.81,9.27 SCHOTTKY.C 14.73,11.43 PWRSWTCH.1
REDLED
  Top 0.254: REDJUMPER.2 34.29,62.74 34.8,62.23 41.4,62.23 41.66,61.98 8-13.10
REDLED2
  Top 0.254: REDJUMPER.1 34.29,68.58 34.04,68.83 30.48,68.83 25.91,64.26 1K.2
REG_IN
  Top 0.813: U$18.6 U$18.5 27.94,13.21 20.57,13.21 19.81,13.97 19.81,16 18.54,17.27 PWRSWTCH.2 16.76,16 0.1UF-5.1
RX0
  Top 0.254: 0-7.8 63.5,61.9 USARTTERM.1
RX1
  Top 0.254: 14-21.6 81.28,64.08 USART1TERM.1
RX2
  Top 0.254: 14-21.4 76.2,63.42 USART2TERM.1
RX3
  Top 0.254: 14-21.2 71.12,61.39 USART3TERM.1
SCK
  Top 0.254: SPITERM.2 94.69,9.14 97.28,9.14 97.54,9.4 97.54,14.73 97.28,14.99 93.22,14.99 92.46,15.75 92.46,18.8 92.71,19.05 38-52.8 93.98,19.05
  Bottom 0.254: U$12.16 92.2,33.53 92.46,33.27 92.46,19.3 92.71,19.05 38-52.8
SCK_SOFT
  Bottom 0.254: SDLVLS.2 30.99,51.82 30.73,52.07 30.73,55.12 29.21,55.12 28.96,55.37 8-13.5
SCL
  Top 0.254: 2.2K.2 84.33,53.09 | 84.33,53.09 83.82,52.58 76.2,52.58 75.95,52.83 DS1307.6 | SCLMOSFET.3 84.84,50.29 84.33,50.8 84.33,53.09 | 14-21.8 86.36,62.05 5VI2CTERM.1
  Bottom 0.254: 14-21.8 86.36,57.91 2.2K.2
SD_CD
  Top 0.254: U$1.CD 25.73,51.13 24.13,49.53 19.05,49.53 18.8,49.78 18.8,55.7 U$2.1
SD_CSIN
  Top 0.254: U$1.1 30.95,33.23 31.24,33.53 31.24,37.34 31.5,37.59 40.13,37.59 40.39,37.85 SDLVLS.8
SD_DATAIN
  Top 0.254: U$1.2 30.14,35.73 30.48,36.07 30.48,41.4 30.73,41.66 SDLVLS.6
SD_SCKIN
  Top 0.254: SDLVLS.3 30.48,46.99 30.48,43.43 30.23,43.18 27.62,43.18 U$1.5
SD_WP
  Top 0.254: U$2.2 27.69,55.88 27.94,55.63 27.94,52.7 U$1.WP
SDA
  Top 0.254: 2.2K-2.2 81.79,53.85 81.28,53.34 78.74,53.34 78.49,53.59 DS1307.5 | 14-21.7 83.82,63.37 5VI2CTERM.2
  Bottom 0.254: 14-21.7 83.82,57.91 2.2K-2.2 81.79,53.85 82.3,53.34 86.36,53.34 86.74,53.72 SDAMOSFET.3
SOLRPOS
  Top 0.813: ZENER.C 6.35,15.49 U$4.2 3.81,12.83 SCHOTTKY.A
SS
  Bottom 0.254: U$12.15 91.44,30.99 91.69,30.73 91.69,15.49 92.96,14.22 98.04,14.22 98.3,14.48 98.3,17.53 96.77,19.05 39-53.8
SS_SOFT
  Bottom 0.254: 8-13.8 36.58,42.16 37.08,41.66 SDLVLS.9 43.69,41.66 43.94,41.91 10K.2
TN9_ACT
  Top 0.254: 0-7.4 53.34,60.76 TN9TERM.2
TN9_CLK
  Top 0.254: 0-7.5 55.88,61.9 TN9TERM.1
TN9_DATA
  Top 0.254: 0-7.3 50.61,59.82 TN9TERM.3
TX0
  Top 0.254: 0-7.7 60.96,60.58 USARTTERM.2
TX1
  Top 0.254: 14-21.5 78.74,64.14 USART1TERM.2
TX2
  Top 0.254: 14-21.3 73.66,62.11 USART2TERM.2
TX3
  Top 0.254: 14-21.1 68.58,60.08 USART3TERM.2
VBAT
  Bottom 0.305: BATT.+2 17.78,65.79 27.18,65.79 30.99,69.6 65.53,69.6 65.79,69.34 65.79,58.42 66.04,58.17 69.09,58.17 69.34,57.91 69.34,52.07 69.85,51.56 75.69,51.56 75.95,51.31 DS1307.3

### Text on the board
tPlace: GND | 5V | DAT | ACT | CLK | TX0 | RX0 | TX3 | RX3 | TX2 | RX2 | TX1 | RX1 | SDA | SCL | SDA | SCL | 5V | 3.3 | 5V | A | GND | 13 | 12 | 11 | 10 | 9 | 8 | 7 | 6 | 5 | 4 | 3 | 2 | 1 | 0 | 14 | 15 | 16 | 17 | 18 | 19 | 20 | 21 | 22 | 7 | 6 | 2 | GND | VCC | 40 | 42 | 44 | 46 | 48 | OFF | SOLR CELL | 50 | - | 52 | + | RES | 3V3 | GND | IO | 5V | GND | Vin | A0 | A1 | A2 | A3 | A4 | A5 | A6 | A7 | A8 | A9 | A10 | A12 | A14 | A15 | ON | MechE | - | Bat | + | 3.3V | GND | 5v | Li- | Li+ | 4.5V | GND | TEMP | 5V | CH1 | CH2 | CH3 | MISO | SCK | MOSI